# Altium schematic sheet 8-8main.SchDoc
size 381 x 241 mm
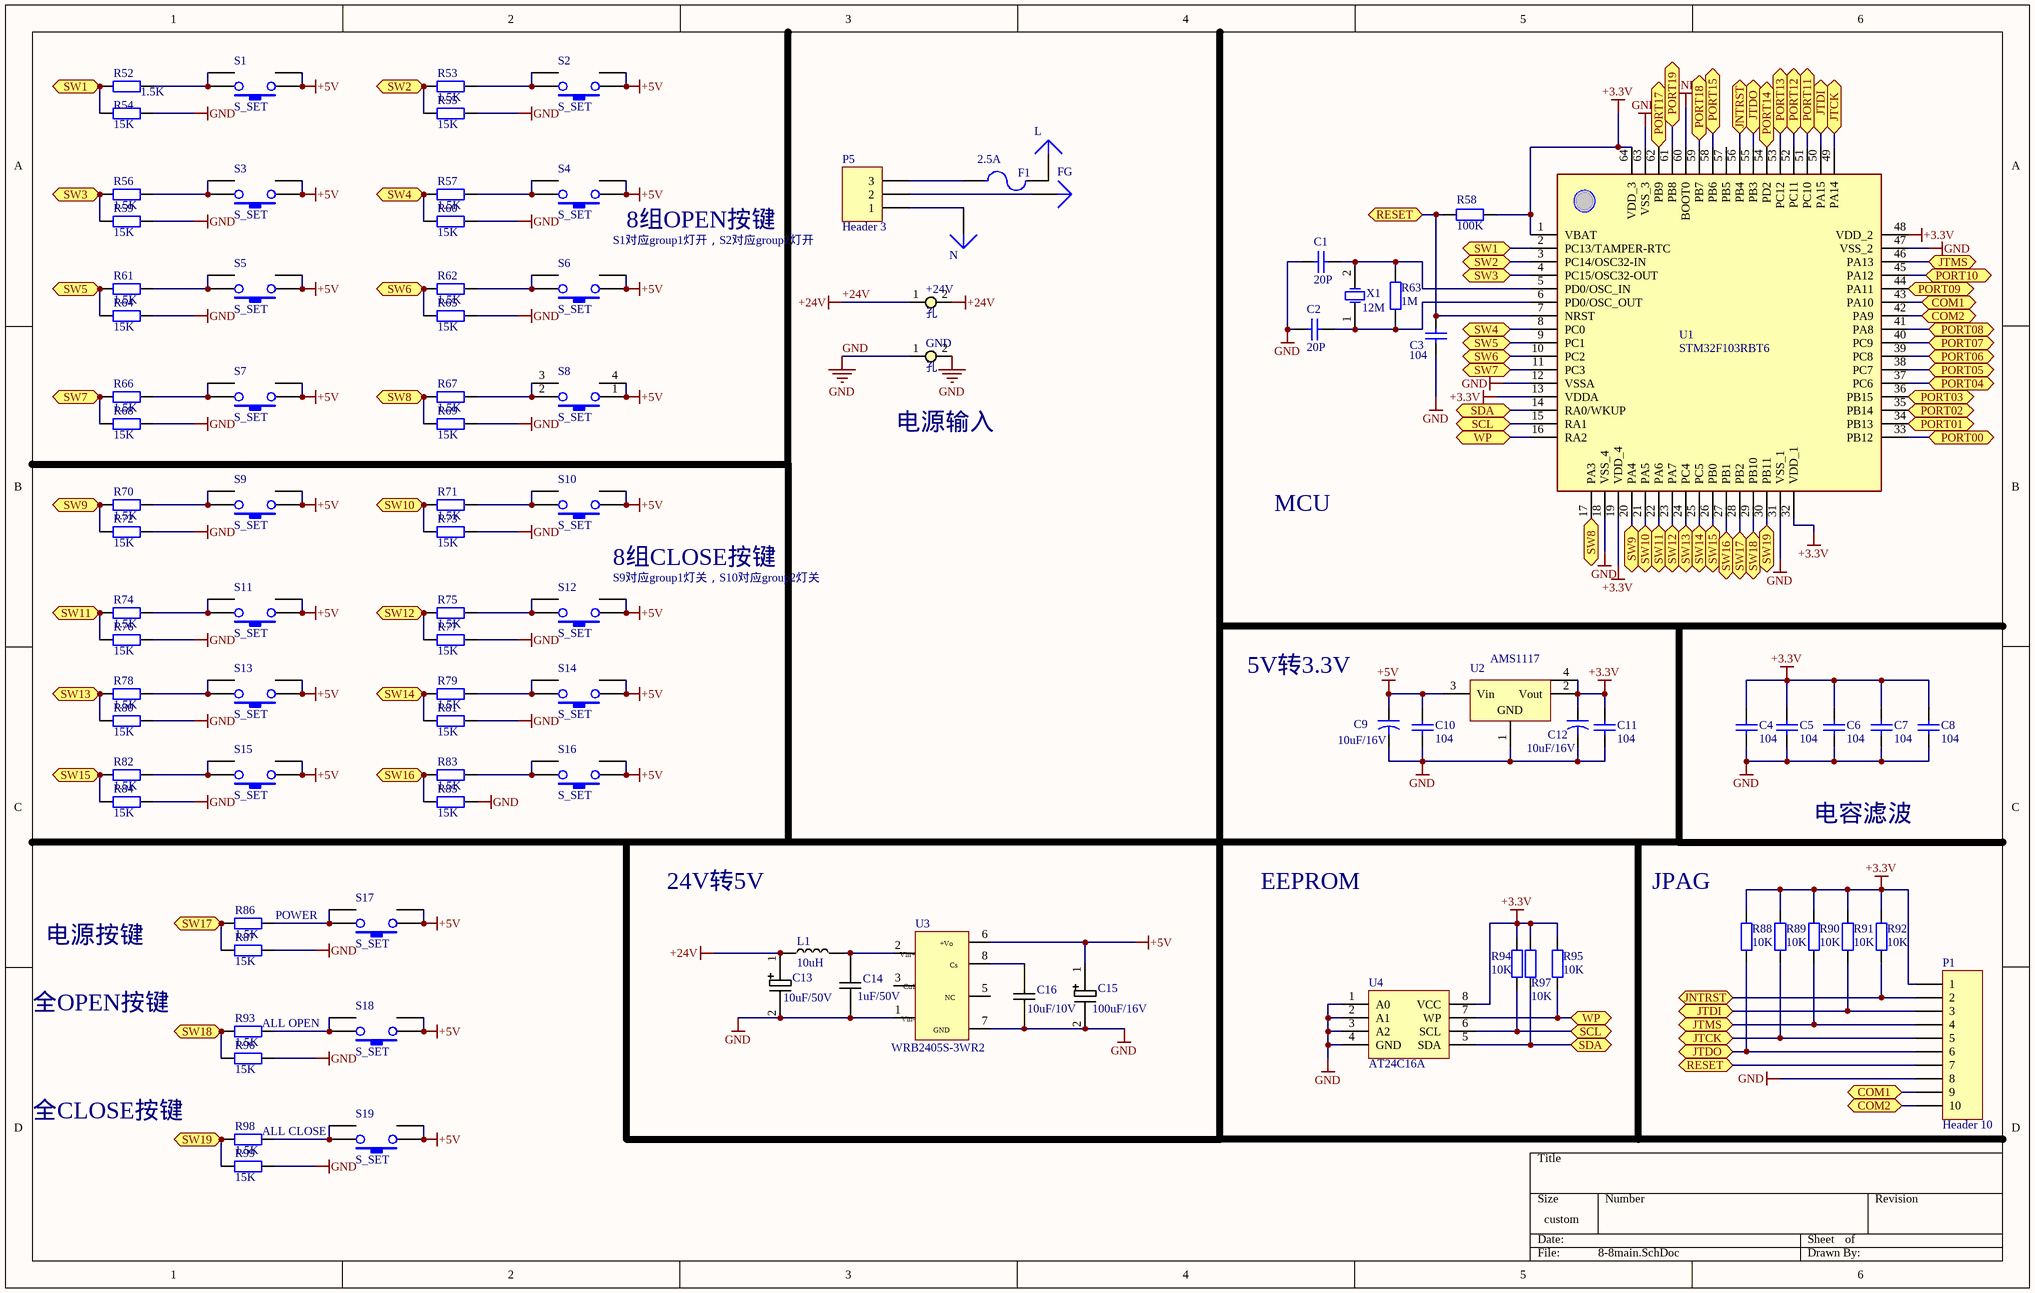
[diagram p0: 8-8main.SchDoc]

## Parts
+24V  孔  [TIMECON2PIN5.1MMA]
C1  value 20P  [0805 C]  (hidden comment: Cap)
C2  value 20P  [0805 C]  (hidden comment: Cap)
C3  value 104  [0805 C]  (hidden comment: Cap)
C4  value 104  [0603 C]  (hidden comment: Cap)
C5  value 104  [0603 C]  (hidden comment: Cap)
C6  value 104  [0603 C]  (hidden comment: Cap)
C7  value 104  [0603 C]  (hidden comment: Cap)
C8  value 104  [0603 C]  (hidden comment: Cap)
C9  value 10uF/16V  [0805 C]
C10  value 104  [0805 C]  (hidden comment: Cap)
C11  value 104  [0805 C]  (hidden comment: Cap)
C12  value 10uF/16V  [0805 C]
C13  value 10uF/50V  [C 10uF/50V]  (hidden comment: CAP Al)
C14  value 1uF/50V  [0805 C]  (hidden comment: CAP)
C15  value 100uF/16V  [C 100uF/16V φ5*11mm SIP]  (hidden comment: CAP Al)
C16  value 10uF/10V  [0805 C]  (hidden comment: CAP)
F1  2.5A  [1A/250V-1]
FG  (no value)  [VIA]
GND  孔  [TIMECON2PIN5.1MMA]
L  (no value)  [VIA]
L1  value 10uH  [L 2.2uH SMD]  (hidden comment: Inductor)
N  (no value)  [VIA]
P1  Header 10  [Header 2*5 SMD]
P5  Header 3  [TIMECON3PIN5.1MMA]
R52  value 1.5K  [0805 R 1/8W]  (hidden comment: Res2)
R53  value 1.5K  [0805 R 1/8W]  (hidden comment: Res2)
R54  value 15K  [0805 R 1/8W]  (hidden comment: Res2)
R55  value 15K  [0805 R 1/8W]  (hidden comment: Res2)
R56  value 1.5K  [0805 R 1/8W]  (hidden comment: Res2)
R57  value 1.5K  [0805 R 1/8W]  (hidden comment: Res2)
R58  value 100K  [0805 R 1/8W]  (hidden comment: Res2)
R59  value 15K  [0805 R 1/8W]  (hidden comment: Res2)
R60  value 15K  [0805 R 1/8W]  (hidden comment: Res2)
R61  value 1.5K  [0805 R 1/8W]  (hidden comment: Res2)
R62  value 1.5K  [0805 R 1/8W]  (hidden comment: Res2)
R63  value 1M  [0805 R 1/8W]  (hidden comment: Res2)
R64  value 15K  [0805 R 1/8W]  (hidden comment: Res2)
R65  value 15K  [0805 R 1/8W]  (hidden comment: Res2)
R66  value 1.5K  [0805 R 1/8W]  (hidden comment: Res2)
R67  value 1.5K  [0805 R 1/8W]  (hidden comment: Res2)
R68  value 15K  [0805 R 1/8W]  (hidden comment: Res2)
R69  value 15K  [0805 R 1/8W]  (hidden comment: Res2)
R70  value 1.5K  [0805 R 1/8W]  (hidden comment: Res2)
R71  value 1.5K  [0805 R 1/8W]  (hidden comment: Res2)
R72  value 15K  [0805 R 1/8W]  (hidden comment: Res2)
R73  value 15K  [0805 R 1/8W]  (hidden comment: Res2)
R74  value 1.5K  [0805 R 1/8W]  (hidden comment: Res2)
R75  value 1.5K  [0805 R 1/8W]  (hidden comment: Res2)
R76  value 15K  [0805 R 1/8W]  (hidden comment: Res2)
R77  value 15K  [0805 R 1/8W]  (hidden comment: Res2)
R78  value 1.5K  [0805 R 1/8W]  (hidden comment: Res2)
R79  value 1.5K  [0805 R 1/8W]  (hidden comment: Res2)
R80  value 15K  [0805 R 1/8W]  (hidden comment: Res2)
R81  value 15K  [0805 R 1/8W]  (hidden comment: Res2)
R82  value 1.5K  [0805 R 1/8W]  (hidden comment: Res2)
R83  value 1.5K  [0805 R 1/8W]  (hidden comment: Res2)
R84  value 15K  [0805 R 1/8W]  (hidden comment: Res2)
R85  value 15K  [0805 R 1/8W]  (hidden comment: Res2)
R86  value 1.5K  [0805 R 1/8W]  (hidden comment: Res2)
R87  value 15K  [0805 R 1/8W]  (hidden comment: Res2)
R88  value 10K  [0805 R 1/8W]  (hidden comment: Res2)
R89  value 10K  [0805 R 1/8W]  (hidden comment: Res2)
R90  value 10K  [0805 R 1/8W]  (hidden comment: Res2)
R91  value 10K  [0805 R 1/8W]  (hidden comment: Res2)
R92  value 10K  [0805 R 1/8W]  (hidden comment: Res2)
R93  value 1.5K  [0805 R 1/8W]  (hidden comment: Res2)
R94  value 10K  [0805 R 1/8W]  (hidden comment: Res2)
R95  value 10K  [0805 R 1/8W]  (hidden comment: Res2)
R96  value 15K  [0805 R 1/8W]  (hidden comment: Res2)
R97  value 10K  [0805 R 1/8W]  (hidden comment: Res2)
R98  value 1.5K  [0805 R 1/8W]  (hidden comment: Res2)
R99  value 15K  [0805 R 1/8W]  (hidden comment: Res2)
S1  S_SET  [12*12*4.3]
S2  S_SET  [12*12*4.3]
S3  S_SET  [12*12*4.3]
S4  S_SET  [12*12*4.3]
S5  S_SET  [12*12*4.3]
S6  S_SET  [12*12*4.3]
S7  S_SET  [12*12*4.3]
S8  S_SET  [12*12*4.3]
S9  S_SET  [12*12*4.3]
S10  S_SET  [12*12*4.3]
S11  S_SET  [12*12*4.3]
S12  S_SET  [12*12*4.3]
S13  S_SET  [12*12*4.3]
S14  S_SET  [12*12*4.3]
S15  S_SET  [12*12*4.3]
S16  S_SET  [12*12*4.3]
S17  S_SET  [12*12*4.3]
S18  S_SET  [12*12*4.3]
S19  S_SET  [12*12*4.3]
U1  STM32F103RBT6  [STM32F103RBT6]
U2  AMS1117  [SOT223_L]
U3  WRB2405S-3WR2  [WRB_S-3WR2]
U4  AT24C16A  [SOIC]
X1  12M  [XTAL SMD]

## Ports
COM1, COM2, JNTRST (bidir), JTCK (bidir), JTDI (bidir), JTDO (bidir), JTMS (bidir), PORT00 (bidir), PORT01 (bidir), PORT02 (bidir), PORT03 (bidir), PORT04 (bidir), PORT05 (bidir), PORT06 (bidir), PORT07 (bidir), PORT08 (bidir), PORT09 (bidir), PORT10 (bidir), PORT11 (bidir), PORT12 (bidir), PORT13 (bidir), PORT14 (bidir), PORT15 (bidir), PORT17 (bidir), PORT18 (bidir), PORT19 (bidir), RESET (bidir), SCL (bidir), SDA (bidir), SW1 (bidir), SW2 (bidir), SW3 (bidir), SW4 (bidir), SW5 (bidir), SW6 (bidir), SW7 (bidir), SW8 (bidir), SW9 (bidir), SW10 (bidir), SW11 (bidir), SW12 (bidir), SW13 (bidir), SW14 (bidir), SW15 (bidir), SW16 (bidir), SW17 (bidir), SW18 (bidir), SW19 (bidir), WP (bidir)

## Nets
+3.3V: C4.1 C5.1 C6.1 C7.1 C8.1 C11.1 C12.1 P1.1 R58.2 R88.2 R89.2 R90.2 R91.2 R92.2 R94.2 R95.2 R97.2 U1.1(VBAT) U1.13(VDDA) U1.19(VDD_4) U1.32(VDD_1) U1.48(VDD_2) U1.64(VDD_3) U2.2(Vout) U2.4(Vout) U4.8(VCC)
+5V: C9.1 C10.1 C15.1 S1.1 S1.4 S2.1 S2.4 S3.1 S3.4 S4.1 S4.4 S5.1 S5.4 S6.1 S6.4 S7.1 S7.4 S8.1 S8.4 S9.1 S9.4 S10.1 S10.4 S11.1 S11.4 S12.1 S12.4 S13.1 S13.4 S14.1 S14.4 S15.1 S15.4 S16.1 S16.4 S17.1 S17.4 S18.1 S18.4 S19.1 S19.4 U2.3(Vin) U3.6
+24V: +24V.1 +24V.2 C13.1 L1.1
GND: C1.2 C2.2 C3.1 C4.2 C5.2 C6.2 C7.2 C8.2 C9.2 C10.2 C11.2 C12.2 C13.2 C14.1 C15.2 C16.1 GND.1 GND.2 P1.8 R54.1 R55.1 R59.1 R60.1 R64.1 R65.1 R68.1 R69.1 R72.1 R73.1 R76.1 R77.1 R80.1 R81.1 R84.1 R85.1 R87.1 R96.1 R99.1 U1.12(VSSA) U1.18(VSS_4) U1.31(VSS_1) U1.47(VSS_2) U1.60(BOOT0) U1.63(VSS_3) U2.1(GND) U3.1 U3.7 U4.1(A0) U4.2(A1) U4.3(A2) U4.4(GND)
COM1: P1.9 U1.43(PA10) ; port COM1
COM2: P1.10 U1.42(PA9) ; port COM2
JNTRST: P1.2 R92.1 U1.56(PB4) ; port JNTRST
JTCK: P1.5 R89.1 U1.49(PA14) ; port JTCK
JTDI: P1.3 R91.1 U1.50(PA15) ; port JTDI
JTDO: P1.6 R88.1 U1.55(PB3) ; port JTDO
JTMS: P1.4 R90.1 U1.46(PA13) ; port JTMS
PORT00: U1.33(PB12) ; port PORT00
PORT01: U1.34(PB13) ; port PORT01
PORT02: U1.35(PB14) ; port PORT02
PORT03: U1.36(PB15) ; port PORT03
PORT04: U1.37(PC6) ; port PORT04
PORT05: U1.38(PC7) ; port PORT05
PORT06: U1.39(PC8) ; port PORT06
PORT07: U1.40(PC9) ; port PORT07
PORT08: U1.41(PA8) ; port PORT08
PORT09: U1.44(PA11) ; port PORT09
PORT10: U1.45(PA12) ; port PORT10
PORT11: U1.51(PC10) ; port PORT11
PORT12: U1.52(PC11) ; port PORT12
PORT13: U1.53(PC12) ; port PORT13
PORT14: U1.54(PD2) ; port PORT14
PORT15: U1.58(PB6) ; port PORT15
PORT17: U1.62(PB9) ; port PORT17
PORT18: U1.59(PB7) ; port PORT18
PORT19: U1.61(PB8) ; port PORT19
RESET: C3.2 P1.7 R58.1 U1.7(NRST) ; port RESET
SCL: R94.1 U1.15(RA1) U4.6(SCL) ; port SCL
SDA: R97.1 U1.14(RA0/WKUP) U4.5(SDA) ; port SDA
SW1: R52.2 R54.2 U1.2(PC13/TAMPER-RTC) ; port SW1
SW2: R53.2 R55.2 U1.3(PC14/OSC32-IN) ; port SW2
SW3: R56.2 R59.2 U1.4(PC15/OSC32-OUT) ; port SW3
SW4: R57.2 R60.2 U1.8(PC0) ; port SW4
SW5: R61.2 R64.2 U1.9(PC1) ; port SW5
SW6: R62.2 R65.2 U1.10(PC2) ; port SW6
SW7: R66.2 R68.2 U1.11(PC3) ; port SW7
SW8: R67.2 R69.2 U1.17(PA3) ; port SW8
SW9: R70.2 R72.2 U1.20(PA4) ; port SW9
SW10: R71.2 R73.2 U1.21(PA5) ; port SW10
SW11: R74.2 R76.2 U1.22(PA6) ; port SW11
SW12: R75.2 R77.2 U1.23(PA7) ; port SW12
SW13: R78.2 R80.2 U1.24(PC4) ; port SW13
SW14: R79.2 R81.2 U1.25(PC5) ; port SW14
SW15: R82.2 R84.2 U1.26(PB0) ; port SW15
SW16: R83.2 R85.2 U1.27(PB1) ; port SW16
SW17: R86.2 R87.2 U1.28(PB2) ; port SW17
SW18: R93.2 R96.2 U1.29(PB10) ; port SW18
SW19: R98.2 R99.2 U1.30(PB11) ; port SW19
WP: R95.1 U1.16(RA2) U4.7(WP) ; port WP
NetC1_1: C1.1 R63.1 U1.5(PD0/OSC_IN) X1.2(OSC2)
NetC2_1: C2.1 R63.2 U1.6(PD0/OSC_OUT) X1.1(OSC1)
NetC14_2: C14.2 L1.2 U3.2
NetC16_2: C16.2 U3.8
NetF1_1: F1.1 P5.3
NetF1_2: F1.2 L.1
NetFG_1: FG.1 P5.2
NetN_1: N.1 P5.1
NetR52_1: R52.1 S1.2 S1.3
NetR53_1: R53.1 S2.2 S2.3
NetR56_1: R56.1 S3.2 S3.3
NetR57_1: R57.1 S4.2 S4.3
NetR61_1: R61.1 S5.2 S5.3
NetR62_1: R62.1 S6.2 S6.3
NetR66_1: R66.1 S7.2 S7.3
NetR67_1: R67.1 S8.2 S8.3
NetR70_1: R70.1 S9.2 S9.3
NetR71_1: R71.1 S10.2 S10.3
NetR74_1: R74.1 S11.2 S11.3
NetR75_1: R75.1 S12.2 S12.3
NetR78_1: R78.1 S13.2 S13.3
NetR79_1: R79.1 S14.2 S14.3
NetR82_1: R82.1 S15.2 S15.3
NetR83_1: R83.1 S16.2 S16.3
NetR86_1: R86.1 S17.2 S17.3
NetR93_1: R93.1 S18.2 S18.3
NetR98_1: R98.1 S19.2 S19.3

Not connected (* = marked no-connect by the designer): U1 57(PB5); U3 3 5

## Notes on the sheet
- 8组OPEN按键
- S1对应group1灯开，S2对应group2灯开
- 电源输入
- 8组CLOSE按键
- MCU
- (near S12) S9对应group1灯关，S10对应group2灯关
- 5V转3.3V
- 电容滤波
- 24V转5V
- EEPROM
- (near R88) JPAG
- 电源按键
- (near R86) POWER
- 全OPEN按键
- (near R93) ALL OPEN
- 全CLOSE按键
- (near R98) ALL CLOSE
- (in symbol WRB2405S-3WR2) +Vo; Vin+; Cs; Ctrl; NC; Vin-; GND

## Library data of the parts
+24V GND = 安装孔3
C1-C8 C10 C11 = Cap: Capacitor; Manufacturer: Generic Components; Class: Passive; Published: 08/06/2000; Publisher: Altium Hobart Technology Centre; SubClass: Capacitor
C9 C12 = Cap2: Capacitor; Published: 23-Sep-2002; PackageReference: CAPR5-4X5; Publisher: Altium Limited
F1 = Fuse 2: Fuse; Published: 8-Jun-2000; LatestRevisionDate: 17-Jul-2002; LatestRevisionNote: Re-released for DXP Platform.; PackageReference: PIN-W2/E2.8; Publisher: Altium Limited
FG L N = PLUG
P1 = Header 10: Header, 10-Pin; LatestRevisionDate: 17-Jul-2002; LatestRevisionNote: Re-released for DXP Platform.; Publisher: Altium Limited
P5 = Header 3: Header, 3-Pin; LatestRevisionDate: 17-Jul-2002; LatestRevisionNote: Re-released for DXP Platform.; Publisher: Altium Limited
R52-R99 = Res2: Resistor; Manufacturer: Generic Components; Class: Passive; Published: 08/06/2000; Publisher: Altium Hobart Technology Centre; SubClass: Resistor
S1-S19 = SW-PB
U1 = STM32F103R8T6
U2 = Volt Reg: Voltage Regulator; Published: 24-Mar-1999; LatestRevisionDate: 29-May-2009; LatestRevisionNote: IPC-7351 Footprint Added.; PackageReference: D2PAK; Publisher: Altium Limited; PackageDescription: 3-Pin Transistor Outline Package 2.54 mm Pitch, 15.1 mm Lead Span
X1 = XTAL: Crystal Oscillator; Manufacturer: Generic Components; Published: 08/06/2000; Publisher: Altium Hobart Technology Centre; Class: Oscillator; SubClass: Crystal Oscillator